# Altium schematic sheet mainSheet.SchDoc
size A4
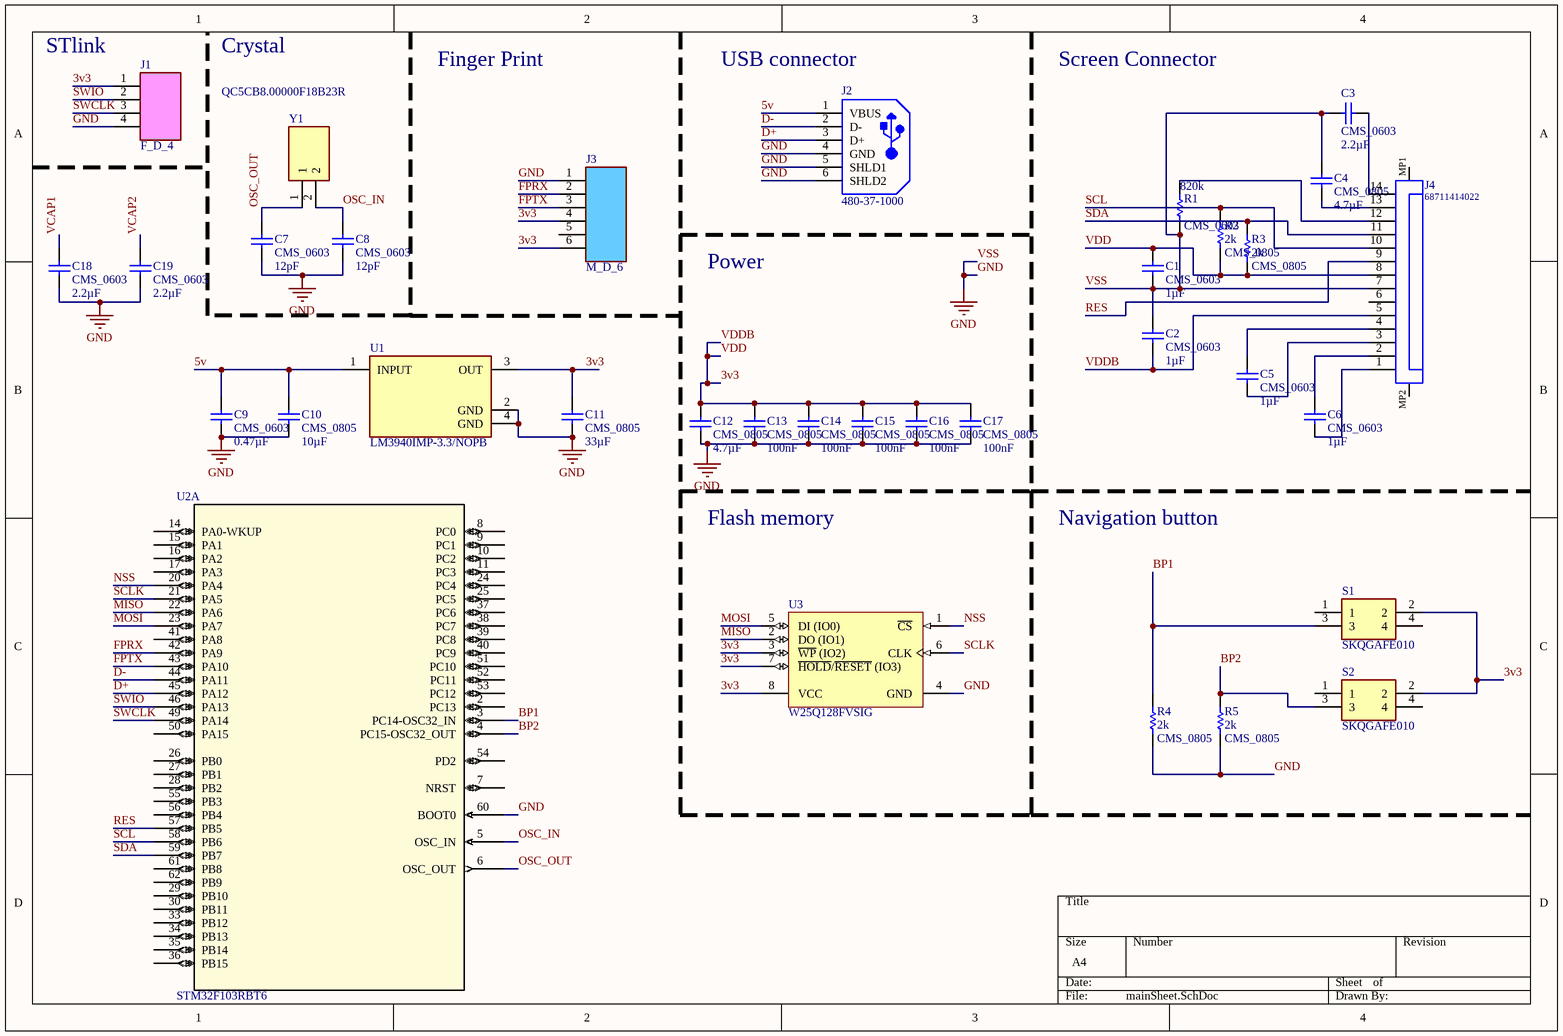
[diagram p0: mainSheet.SchDoc]

## Parts
C1  Condo: 1µF  [CONDENSATEUR_CMS_0603]  (hidden comment: CMS_0603)
C2  Condo: 1µF  [CONDENSATEUR_CMS_0603]  (hidden comment: CMS_0603)
C3  Condo: 2.2µF  [CONDENSATEUR_CMS_0603]  (hidden comment: CMS_0603)
C4  16v / x7r: 4.7µF  [CONDENSATEUR_CMS_0805]  (hidden comment: CMS_0805)
C5  16v X5R: 1µF  [CONDENSATEUR_CMS_0603]  (hidden comment: CMS_0603)
C6  16v X5R: 1µF  [CONDENSATEUR_CMS_0603]  (hidden comment: CMS_0603)
C7  Condo: 12pF  [CONDENSATEUR_CMS_0603]  (hidden comment: CMS_0603)
C8  Condo: 12pF  [CONDENSATEUR_CMS_0603]  (hidden comment: CMS_0603)
C9  Condo: 0.47µF  [CONDENSATEUR_CMS_0603]  (hidden comment: CMS_0603)
C10  value 10µF  [CONDENSATEUR_CMS_0805]  (hidden comment: CMS_0805)
C11  value 33µF  [CONDENSATEUR_CMS_0805]  (hidden comment: CMS_0805)
C12  16v / x7r: 4.7µF  [CONDENSATEUR_CMS_0805]  (hidden comment: CMS_0805)
C13  value 100nF  [CONDENSATEUR_CMS_0805]  (hidden comment: CMS_0805)
C14  value 100nF  [CONDENSATEUR_CMS_0805]  (hidden comment: CMS_0805)
C15  value 100nF  [CONDENSATEUR_CMS_0805]  (hidden comment: CMS_0805)
C16  value 100nF  [CONDENSATEUR_CMS_0805]  (hidden comment: CMS_0805)
C17  value 100nF  [CONDENSATEUR_CMS_0805]  (hidden comment: CMS_0805)
C18  Condo: 2.2µF  [CONDENSATEUR_CMS_0603]  (hidden comment: CMS_0603)
C19  Condo: 2.2µF  [CONDENSATEUR_CMS_0603]  (hidden comment: CMS_0603)
J1  Type: F_D_4  [BARRETTE_4_F_D]  (hidden comment: BARRETTE_4 CONTACTS_1 RANGEE_FEMELLE_DROITE)
J2  480-37-1000  [MOLX-480-37-1000_V]
J3  Type: M_D_6  [BARRETTE_6_M_D]  (hidden comment: BARRETTE_6 CONTACTS_1 RANGEE_MALE_DROITE)
J4  68711414022  [68711414022]
R1  value 820k  Type: CMS_0603  [RESISTANCE_CMS_0603]  (hidden comment: RESISTANCE_CMS_0603)
R2  value 2k  Type: CMS_0805  [RESISTANCE_CMS_0805]  (hidden comment: RESISTANCE_CMS_0805)
R3  value 2k  Type: CMS_0805  [RESISTANCE_CMS_0805]  (hidden comment: RESISTANCE_CMS_0805)
R4  value 2k  Type: CMS_0805  [RESISTANCE_CMS_0805]  (hidden comment: RESISTANCE_CMS_0805)
R5  value 2k  Type: CMS_0805  [RESISTANCE_CMS_0805]  (hidden comment: RESISTANCE_CMS_0805)
S1  SKQGAFE010  [SKQGAKE010]
S2  SKQGAFE010  [SKQGAKE010]
U1  LM3940IMP-3.3/NOPB  [FP-DCY0004A-IPC_C]
U2  STM32F103RBT6  [LQFP64-10x10mm]  (part A of 2)
U3  W25Q128FVSIG  [WINB-SOIC-8_N]
Y1  QC5CB8.00000F18B23R  [QC5CB]

## Nets
GND: C1.1 C2.2 C3.1 C4.2 C7.1 C8.1 C9.1 C10.1 C11.1 C12.2 C13.1 C14.1 C15.1 C16.1 C17.1 C18.1 C19.1 J1.4 J2.4(GND) J2.5(SHLD1) J2.6(SHLD2) J3.1 J4.7 R1.1 R4.1 R5.1 U1.2(GND) U1.4(GND) U2.60(BOOT0) U3.4(GND)  [also labelled VSS]
3v3: C1.2 C2.1 C11.2 C12.1 C13.2 C14.2 C15.2 C16.2 C17.2 J1.1 J3.4 J3.6 J4.5 J4.8 R2.1 R3.1 S1.2 S2.2 U1.3(OUT) U3.3(~{WP}_(IO2)) U3.7(~{HOLD}/~{RESET}_(IO3)) U3.8(VCC)  [also labelled VDD, VDDB]
5v: C9.2 C10.2 J2.1(VBUS) U1.1(INPUT)
BP1: R4.2 S1.3 U2.3(PC14-OSC32_IN)
BP2: R5.2 S2.3 U2.4(PC15-OSC32_OUT)
D+: J2.3(D+) U2.45(PA12)
D-: J2.2(D-) U2.44(PA11)
FPRX: J3.2 U2.42(PA9)
FPTX: J3.3 U2.43(PA10)
MISO: U2.22(PA6) U3.2(DO_(IO1))
MOSI: U2.23(PA7) U3.5(DI_(IO0))
NSS: U2.20(PA4) U3.1(~{CS})
OSC_IN: C8.2 U2.5(OSC_IN) Y1.2
OSC_OUT: C7.2 U2.6(OSC_OUT) Y1.1
RES: J4.9 U2.57(PB5)
SCL: J4.10 R2.2 U2.58(PB6)
SCLK: U2.21(PA5) U3.6(CLK)
SDA: J4.11 R3.2 U2.59(PB7)
SWCLK: J1.3 U2.49(PA14)
SWIO: J1.2 U2.46(PA13)
VCAP1: C18.2
VCAP2: C19.2
NetC3_2: C3.2 J4.14
NetC4_1: C4.1 J4.13
NetC5_1: C5.1 J4.3
NetC5_2: C5.2 J4.4
NetC6_1: C6.1 J4.1
NetC6_2: C6.2 J4.2
NetJ4_12: J4.12 R1.2

Not connected (* = marked no-connect by the designer): J3 5; J4 6 MP1 MP2; S1 1 4; S2 1 4; U2 2(PC13) 7(NRST) 8(PC0) 9(PC1) 10(PC2) 11(PC3) 14(PA0-WKUP) 15(PA1) 16(PA2) 17(PA3) 24(PC4) 25(PC5) 26(PB0) 27(PB1) 28(PB2) 29(PB10) 30(PB11) 33(PB12) 34(PB13) 35(PB14) 36(PB15) 37(PC6) 38(PC7) 39(PC8) 40(PC9) 41(PA8) 50(PA15) 51(PC10) 52(PC11) 53(PC12) 54(PD2) 55(PB3) 56(PB4) 61(PB8) 62(PB9)

## Notes on the sheet
- (near J1) STlink
- Crystal
- Finger Print
- (near J2) USB connector
- Screen Connector
- Power
- Flash memory
- Navigation button

## Library data of the parts
C1-C3 C5-C9 C18 C19 = CONDENSATEUR_CMS_CER_0603: CONDENSATEUR CMS CERAMIQUE 0603; Type: CMS_0603
C4 C10-C17 = CONDENSATEUR_CMS_CER_0805: CONDENSATEUR CMS CERAMIQUE 0805; Type: CMS_0805
J1 = BARRETTE_4 CONTACTS_1 RANGEE_FEMELLE_DROITE: BARRETTE 4 CONTACTS 1 RANGEE FEMELLE DROITE
J2 = CMP-1676-00005-1: Universal Serial Bus (USB) Shielded I/O Plug, Type A, Right Angle Connector, 1.5 A, -20 to 85 degC, 4-Pin SMD, RoHS, Tray; Tolerance: 1%; Power Rating: 100 mW; Voltage Rating: 50 V; Case\Package: 0603; Resistance: 1 mohm; Width: 0.8 mm; Mount: Surface Mount; ComponentLink1URL: http://www.molex.com/; ComponentLink1Description: Manufacturer URL; REACH SVHC: No SVHC; Case Code (Imperial): 0603; Height: 0.45 mm; Max Operating Temperature: 155 degC; ComponentLink2Description: Datasheet; Min Operating Temperature: -55 degC; Length: 1.6 mm; Pins: 2; RoHSCompliant: true; Package Quantity: 5000; DatasheetVersion: Rev. D, 06/2004; PackageDescription: 4-Pin Surface Mount Device, Body 12 x 18.8 mm; Voltage Rating (DC): 50 V; PackageReference: 480-37-1000; Case Code (Metric): 1608; ComponentLink2URL: http://www.molex.com/pdm_docs/sd/480371000_sd.pdf; Packaging: Tape and Reel
J3 = BARRETTE_6 CONTACTS_1 RANGEE_MALE_DROITE: BARRETTE 6 CONTACTS 1 RANGEE MALE DROITE
J4 = CMP-1502-01553-1: SMT ZIF Connectors WR-FPC, Horizontal, Top Contact, pitch 0.5 mm, 14 pins; Manufacturer: Wurth Elektronik; Pitch: 0.5mm; Contact Resistance: 20mOhm; Withstanding Voltage: 250VAC; Working Voltage: 50VAC; Pin Number: 14; Rated Current: 0.5A; Operating Temperature: -25to85degC; Mounting Technology: SMT; Packaging: TapeandReel; Part Number: 68711414022; Datasheet URL: https://katalog.we-online.de/em/datasheet/68711414022.pdf; Package Reference: 68711414022; Contact Design: TopContact; Publisher: WurthElektronik; Manufacturer URL: http://www.we-online.de; Orientation: Horizontal
R1 = RESISTANCE_CMS_0603: RESISTANCE CMS 0603
R2-R5 = RESISTANCE_CMS_0805: RESISTANCE CMS 0805
S1 S2 = SKQGAFE010: Switch; Manufacturer_Name: ALPS Electric; Datasheet Link: http://uk.rs-online.com/web/p/products/7582060P; RS Part Number: 7582060P; RS Price/Stock: http://uk.rs-online.com/web/p/products/7582060P; Manufacturer_Part_Number: SKQGAFE010
U1 = CMP-0062-01788-4: IC REG LINEAR 3.3V 1A SOT223-4; Min Input Voltage: 4.5V; Max Supply Voltage: 7.5V; Number of Outputs: 1; Output Type: Fixed; Polarity: Positive; Dropout Voltage: 500mV; Quiescent Current: 15mA; Max Output Voltage: 3.3V; Length: 6.5mm; Termination: SMD/SMT; Width: 3.56mm; Min Supply Voltage: 4.5V; Max Output Current: 1A; Case/Package: SOT-223; Output Voltage: 3.3V; Current Rating: 1A; Packaging: Tape and Reel; Lead Free: Lead Free; Nominal Output Voltage: 3.3V; Height: 1.6mm; Series: -; Output Configuration: Positive; Radiation Hardening: No; Number of Regulators: 1; Package Quantity: 1000; REACH SVHC: No SVHC; Max Input Voltage: 7.5V; Max Operating Temperature: 125°C; Min Operating Temperature: -40°C; Output Current: 1A; Contact Plating: Tin; Number of Pins: 4; Mount: Surface Mount
U2 = STM32F103RBT6: No Description Available; Mfr_Name: STMicroelectronics; Copyright: Copyright (C) 2022 Ultra Librarian. All rights reserved.; Manufacturer_Part_Number: STM32F103RBT6; RefDes: RefDes; Type: DEV
U3 = CMP-2000-05005-1: 3V 128M-Bit Serial Flash Memory with Dual/Quad SPI & QPI, 2.7 to 3.6 V, -40 to 85 degC, 8-Pin SOIC, RoHS, Tape and Reel; Manufacturer: Winbond; Number of Words: 16777216; Address Bus: 24b; Word Size: 8b; Boot Type: NotRequired; Supply Current: 20mA; Operating Supply Voltage (Max): 3.6V; Sync/Async: Synchronous; Rad Hardened: No; Interface Type: Serial(SPI); Access Time (Max): 7ns; Operating Supply Voltage (Min): 2.7V; Operating Supply Voltage (Typ): 3/3.3V; Programmable: Yes; Density: 134217728Bit; Cell Type: NOR; Package Description: 8-Pin Small Outline Integrated Circuit, Body 5.28 x 5.28 mm, Pitch 1.27 mm; Datasheet URL: http://download.siliconexpert.com/pdfs/2015/11/30/6/42/17/890/win_/manual/3w25q128fv20rev.l2008242015.pdf; Package Reference: SS-8; Package Type: SOICW; Datasheet Version: Rev. L, 08/2015; Manufacturer URL: http://www.winbond.com/hq/index.html?__locale=en; Pin Count: 8; Operating Temperature Classification: Industrial; Operating Temperature (Min): -40C; Program/Erase Volt (Typ): 2.7to3.6V; Operating Temperature (Max): 85C; Mounting: SurfaceMount; Operating Temp Range: -40Cto85C
Y1 = QC5CB8.00000F18B23R: Crystal or Oscillator; Manufacturer_Name: Qantek; Datasheet Link: http://uk.rs-online.com/web/p/products/8136093P; RS Part Number: 8136093P; RS Price/Stock: http://uk.rs-online.com/web/p/products/8136093P; Manufacturer_Part_Number: QC5CB8.00000F18B23R